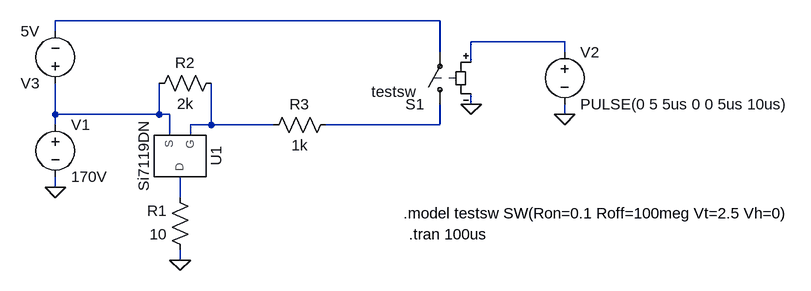
[diagram p0: schematic SI7119DN test.asc]
SI7119DN test.asc, the LTspice schematic file:
Version 4
SHEET 1 1160 680
WIRE 560 -32 -32 -32
WIRE -32 -16 -32 -32
WIRE 752 0 608 0
WIRE 560 16 560 -32
WIRE 752 16 752 0
WIRE 608 32 608 0
WIRE 608 96 608 80
WIRE -32 112 -32 64
WIRE 128 112 128 64
WIRE 128 112 -32 112
WIRE 144 112 128 112
WIRE 752 112 752 96
WIRE -32 128 -32 112
WIRE 208 128 208 64
WIRE 208 128 176 128
WIRE 304 128 208 128
WIRE 560 128 560 96
WIRE 560 128 384 128
WIRE 144 144 144 112
WIRE 176 144 176 128
WIRE -32 224 -32 208
WIRE 160 240 160 208
WIRE 160 336 160 320
FLAG -32 224 0
FLAG 608 96 0
FLAG 752 112 0
FLAG 160 336 0
SYMBOL AutoGenerated\\Si7119DN 160 176 M270
SYMATTR InstName U1
SYMBOL res 176 336 R180
WINDOW 0 36 76 Left 2
WINDOW 3 36 40 Left 2
SYMATTR InstName R1
SYMATTR Value 10
SYMBOL voltage -32 112 R0
WINDOW 123 0 0 Left 0
WINDOW 39 0 0 Left 0
SYMATTR InstName V1
SYMATTR Value 170V
SYMBOL voltage 752 0 R0
WINDOW 123 0 0 Left 0
WINDOW 39 0 0 Left 0
SYMATTR InstName V2
SYMATTR Value PULSE(0 5 5us 0 0 5us 10us)
SYMBOL sw 560 112 R180
WINDOW 3 37 35 Left 2
SYMATTR Value testsw
SYMATTR InstName S1
SYMBOL voltage -32 80 R180
WINDOW 123 0 0 Left 0
WINDOW 39 0 0 Left 0
SYMATTR InstName V3
SYMATTR Value 5V
SYMBOL res 224 48 R90
WINDOW 0 0 56 VBottom 2
WINDOW 3 32 56 VTop 2
SYMATTR InstName R2
SYMATTR Value 2k
SYMBOL res 400 112 R90
WINDOW 0 0 56 VBottom 2
WINDOW 3 32 56 VTop 2
SYMATTR InstName R3
SYMATTR Value 1k
TEXT 512 296 Left 2 !.tran 100us
TEXT 504 264 Left 2 !.model testsw SW(Ron=0.1 Roff=100meg Vt=2.5 Vh=0)

The netlist it stands for:
* SI7119DN test.asc
XU1 N006 N004 N003 Si7119DN  ; pins D G S
R1 0 N006 10
V1 N003 0 170V
V2 N002 0 PULSE(0 5 5us 0 0 5us 10us)
S1 N005 N001 N002 0 testsw
V3 N003 N001 5V
R2 N004 N003 2k
R3 N005 N004 1k
.tran 100us
.model testsw SW(Ron=0.1 Roff=100meg Vt=2.5 Vh=0)
.lib Z:\media\Daten\Projekte\ELController\ltspice model\si7119dn\si7119dn_ps.lib
.backanno
.end